# Altium schematic sheet MCU.SchDoc
size A3; SheetNumber: 5; SheetTotal: 8
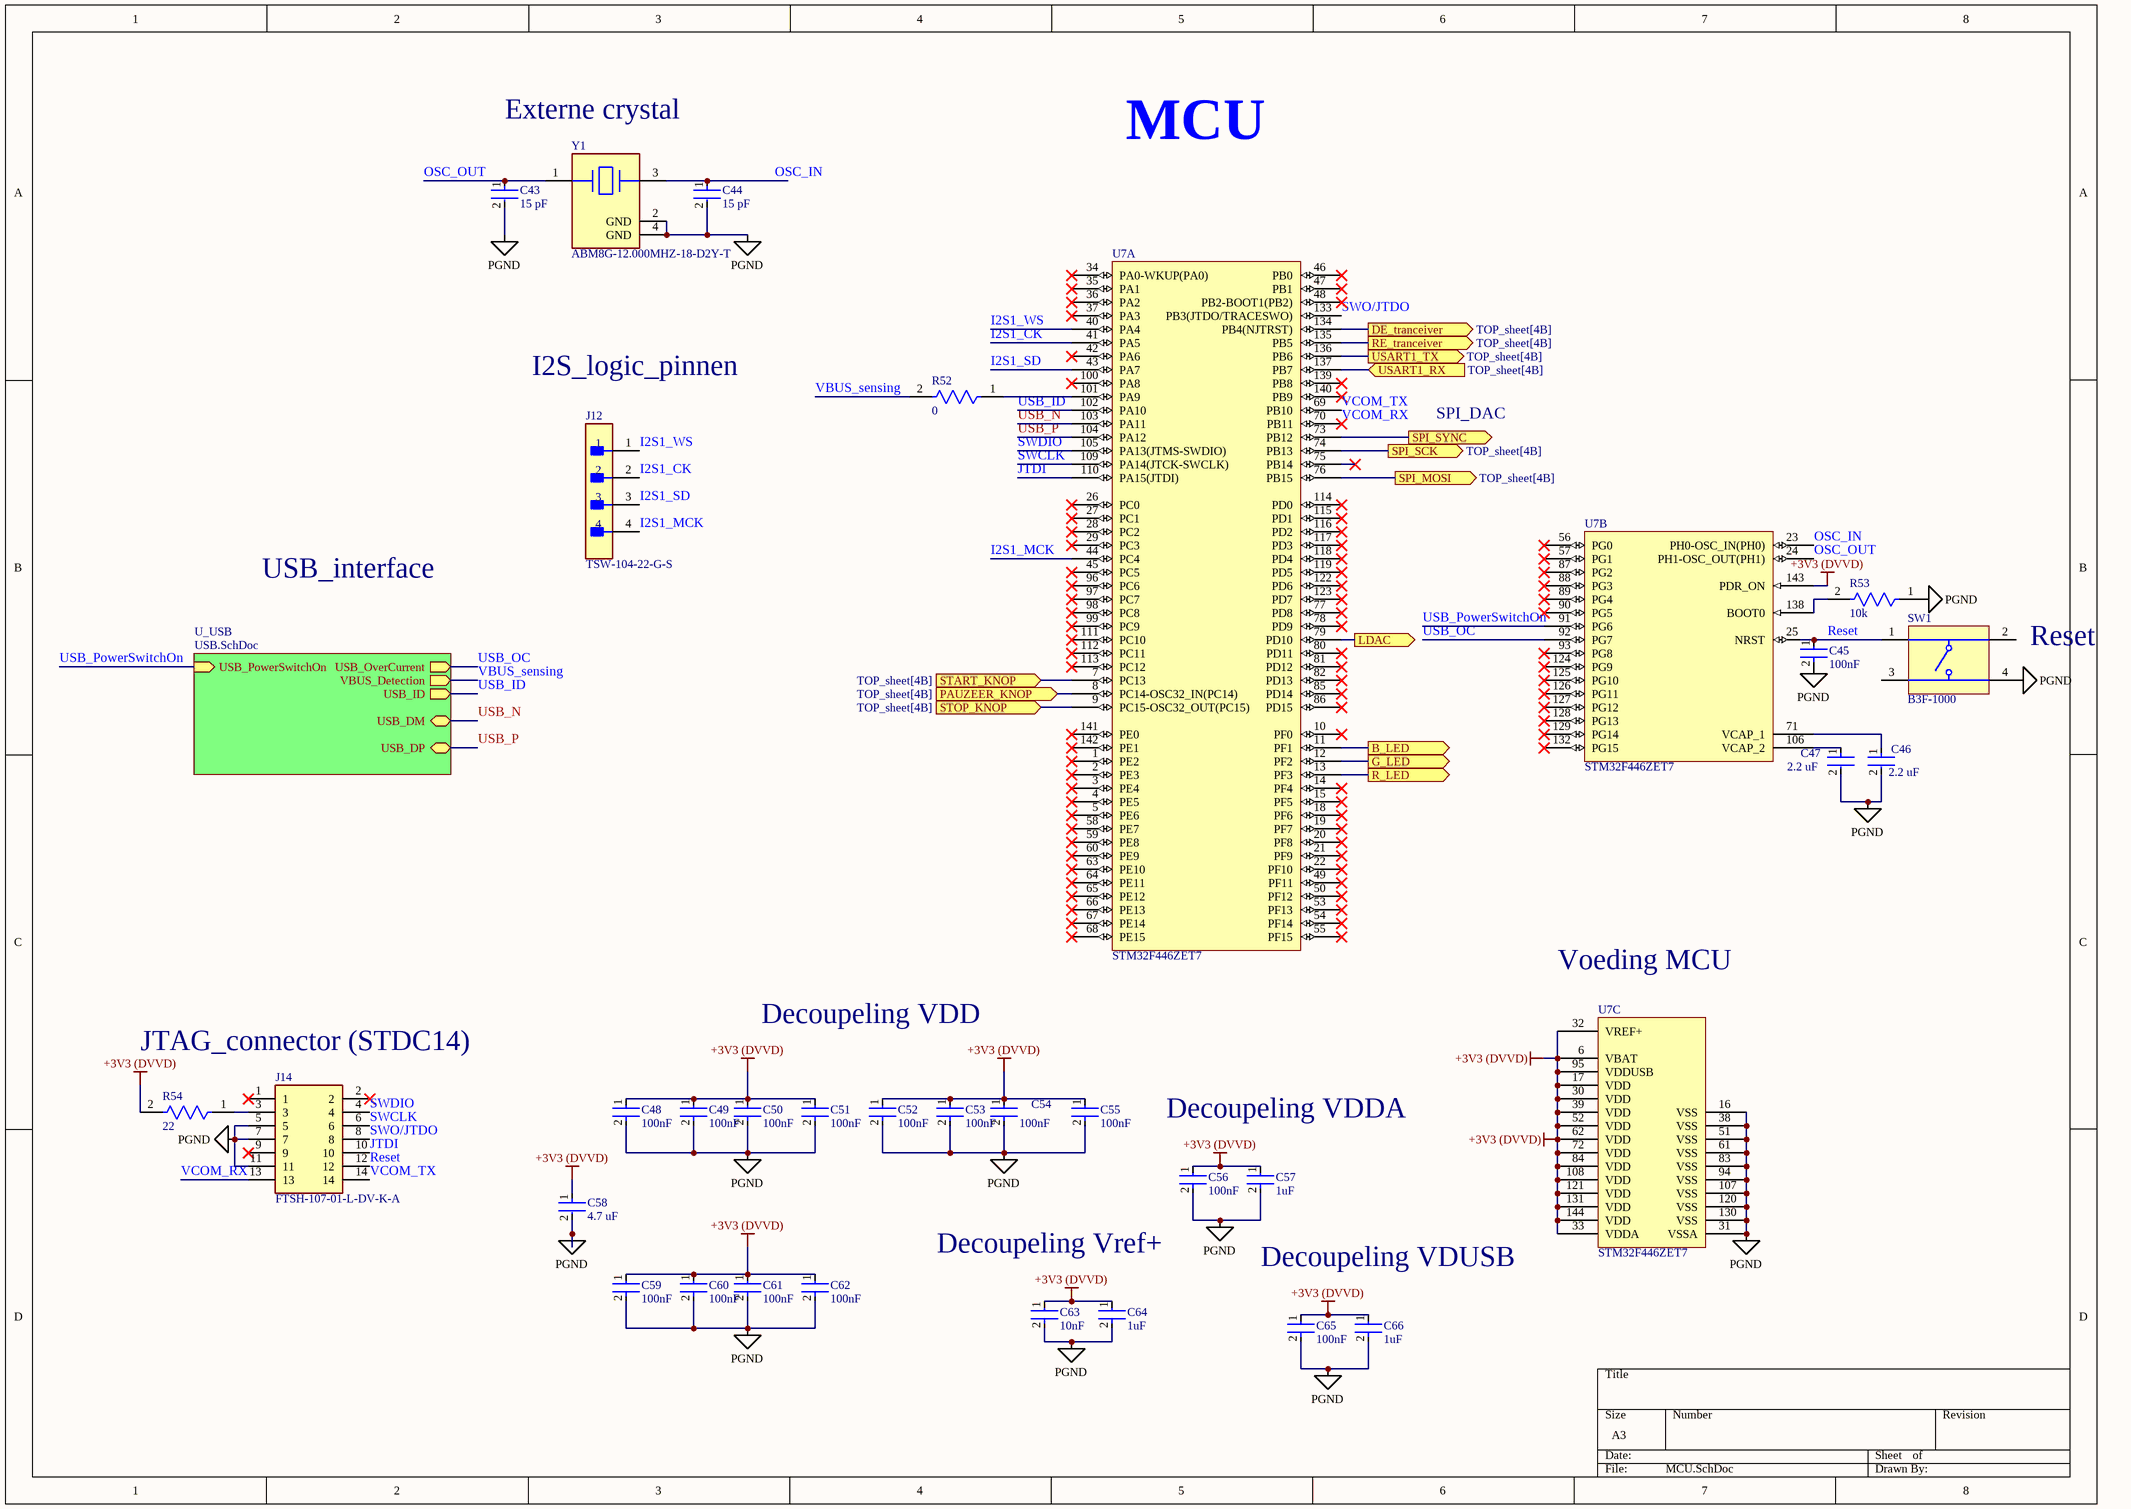
[diagram p0: MCU.SchDoc]

## Parts
C43  15 pF  [FP-AC0603-MFG]
C44  15 pF  [FP-AC0603-MFG]
C45  100nF  [FP-GRM15-MFG]
C46  2.2 uF  [FP-C0603C-CF-MFG]
C47  2.2 uF  [FP-C0603C-CF-MFG]
C48  100nF  [FP-GRM15-MFG]
C49  100nF  [FP-GRM15-MFG]
C50  100nF  [FP-GRM15-MFG]
C51  100nF  [FP-GRM15-MFG]
C52  100nF  [FP-GRM15-MFG]
C53  100nF  [FP-GRM15-MFG]
C54  100nF  [FP-GRM15-MFG]
C55  100nF  [FP-GRM15-MFG]
C56  100nF  [FP-GRM15-MFG]
C57  1uF  [FP-GRM15-MFG]
C58  4.7 uF  [FP-C0603C-CF-MFG]
C59  100nF  [FP-GRM15-MFG]
C60  100nF  [FP-GRM15-MFG]
C61  100nF  [FP-GRM15-MFG]
C62  100nF  [FP-GRM15-MFG]
C63  10nF  [FP-GRM15-MFG]
C64  1uF  [FP-GRM15-MFG]
C65  100nF  [FP-GRM15-MFG]
C66  1uF  [FP-GRM15-MFG]
J12  TSW-104-22-G-S  [FP-TSW-104-22-G-S-MFG]
J14  FTSH-107-01-L-DV-K-A  [FTSH-107-XX-YYY-DV-K-A]
R52  0  [FP-CRCW1206-MFG]
R53  10k  [FP-RC1608-IPC_B]
R54  22  [FP-RC1608-IPC_B]
SW1  B3F-1000  [OMRON-B3F-1000-4_V]
U7  STM32F446ZET7  [STM-LQFP144_M]  (parts A,B,C of 3)
Y1  ABM8G-12.000MHZ-18-D2Y-T  [FP-ABM8G-MFG]

## Sub-sheets
U_USB = USB.SchDoc: USB_PowerSwitchOn (in), USB_OverCurrent (out), USB_DM (bidir), USB_DP (bidir), VBUS_Detection (out), USB_ID (out)

## Ports
B_LED (out, see TOP_sheet[4B]), DE_tranceiver (out, see TOP_sheet[4B]), G_LED (out, see TOP_sheet[4B]), LDAC (out, see TOP_sheet[4B], DAC[1B]), PAUZEER_KNOP (in, see TOP_sheet[4B]), R_LED (out, see TOP_sheet[4B]), RE_tranceiver (out, see TOP_sheet[4B]), SPI_MOSI (out, see TOP_sheet[4B]), SPI_SCK (out, see TOP_sheet[4B]), SPI_SYNC (out, see TOP_sheet[4B]), START_KNOP (in, see TOP_sheet[4B]), STOP_KNOP (in, see TOP_sheet[4B]), USART1_RX (in, see TOP_sheet[4B]), USART1_TX (out, see TOP_sheet[4B])

## Nets
+3V3 (DVVD): C48.1 C49.1 C50.1 C51.1 C52.1 C53.1 C54.1 C55.1 C56.1 C57.1 C58.1 C59.1 C60.1 C61.1 C62.1 C63.1 C64.1 C65.1 C66.1 R54.2 U7.6(VBAT) U7.17(VDD) U7.30(VDD) U7.32(VREF+) U7.33(VDDA) U7.39(VDD) U7.52(VDD) U7.62(VDD) U7.72(VDD) U7.84(VDD) U7.95(VDDUSB) U7.108(VDD) U7.121(VDD) U7.131(VDD) U7.143(PDR_ON) U7.144(VDD)
PGND: C43.2 C44.2 C45.2 C46.2 C47.2 C48.2 C49.2 C50.2 C51.2 C52.2 C53.2 C54.2 C55.2 C56.2 C57.2 C58.2 C59.2 C60.2 C61.2 C62.2 C63.2 C64.2 C65.2 C66.2 J14.5 J14.7 J14.11 R53.1 SW1.4 U7.16(VSS) U7.31(VSSA) U7.38(VSS) U7.51(VSS) U7.61(VSS) U7.83(VSS) U7.94(VSS) U7.107(VSS) U7.120(VSS) U7.130(VSS) Y1.2(GND) Y1.4(GND)
B_LED: U7.11(PF1) ; port B_LED
DE_tranceiver: U7.134(PB4(NJTRST)) ; port DE_tranceiver
G_LED: U7.12(PF2) ; port G_LED
I2S1_CK: J12.2 U7.41(PA5)
I2S1_MCK: J12.4 U7.44(PC4)
I2S1_SD: J12.3 U7.43(PA7)
I2S1_WS: J12.1 U7.40(PA4)
JTDI: J14.10 U7.110(PA15(JTDI))
LDAC: U7.79(PD10) ; port LDAC
OSC_IN: C44.1 U7.23(PH0-OSC_IN(PH0)) Y1.3
OSC_OUT: C43.1 U7.24(PH1-OSC_OUT(PH1)) Y1.1
PAUZEER_KNOP: U7.8(PC14-OSC32_IN(PC14)) ; port PAUZEER_KNOP
R_LED: U7.13(PF3) ; port R_LED
RE_tranceiver: U7.135(PB5) ; port RE_tranceiver
Reset: C45.1 J14.12 SW1.1 U7.25(NRST)
SPI_MOSI: U7.76(PB15) ; port SPI_MOSI
SPI_SCK: U7.74(PB13) ; port SPI_SCK
SPI_SYNC: U7.73(PB12) ; port SPI_SYNC
START_KNOP: U7.7(PC13) ; port START_KNOP
STOP_KNOP: U7.9(PC15-OSC32_OUT(PC15)) ; port STOP_KNOP
SWCLK: J14.6 U7.109(PA14(JTCK-SWCLK))
SWDIO: J14.4 U7.105(PA13(JTMS-SWDIO))
SWO/JTDO: J14.8 U7.133(PB3(JTDO/TRACESWO))
USART1_RX: U7.137(PB7) ; port USART1_RX
USART1_TX: U7.136(PB6) ; port USART1_TX
USB_ID: U7.102(PA10) ; sheet U_USB/USB_ID
USB_N: U7.103(PA11) ; sheet U_USB/USB_DM
USB_OC: U7.92(PG7) ; sheet U_USB/USB_OverCurrent
USB_P: U7.104(PA12) ; sheet U_USB/USB_DP
USB_PowerSwitchOn: U7.91(PG6) ; sheet U_USB/USB_PowerSwitchOn
VBUS_sensing: R52.2 ; sheet U_USB/VBUS_Detection
VCOM_RX: J14.13 U7.70(PB11)
VCOM_TX: J14.14 U7.69(PB10)
NetC46_1: C46.1 U7.71(VCAP_1)
NetC47_1: C47.1 U7.106(VCAP_2)
NetJ14_3: J14.3 R54.1
NetR52_1: R52.1 U7.101(PA9)
NetR53_2: R53.2 U7.138(BOOT0)

Not connected (* = marked no-connect by the designer): J14 1* 2* 9*; SW1 2 3; U7 1(PE2)* 2(PE3)* 3(PE4)* 4(PE5)* 5(PE6)* 10(PF0)* 14(PF4)* 15(PF5)* 18(PF6)* 19(PF7)* 20(PF8)* 21(PF9)* 22(PF10)* 26(PC0)* 27(PC1)* 28(PC2)* 29(PC3)* 34(PA0-WKUP(PA0))* 35(PA1)* 36(PA2)* 37(PA3)* 42(PA6)* 45(PC5)* 46(PB0)* 47(PB1)* 48(PB2-BOOT1(PB2))* 49(PF11)* 50(PF12)* 53(PF13)* 54(PF14)* 55(PF15)* 56(PG0)* 57(PG1)* 58(PE7)* 59(PE8)* 60(PE9)* 63(PE10)* 64(PE11)* 65(PE12)* 66(PE13)* 67(PE14)* 68(PE15)* 75(PB14)* 77(PD8)* 78(PD9)* 80(PD11)* 81(PD12)* 82(PD13)* 85(PD14)* 86(PD15)* 87(PG2)* 88(PG3)* 89(PG4)* 90(PG5)* 93(PG8)* 96(PC6)* 97(PC7)* 98(PC8)* 99(PC9)* 100(PA8)* 111(PC10)* 112(PC11)* 113(PC12)* 114(PD0)* 115(PD1)* 116(PD2)* 117(PD3)* 118(PD4)* 119(PD5)* 122(PD6)* 123(PD7)* 124(PG9)* 125(PG10)* 126(PG11)* 127(PG12)* 128(PG13)* 129(PG14)* 132(PG15)* 139(PB8)* 140(PB9)* 141(PE0)* 142(PE1)*

## Notes on the sheet
- Externe crystal
- MCU
- I2S_logic_pinnen
- SPI_DAC
- USB_interface
- (near SW1) Reset
- Voeding MCU
- JTAG_connector (STDC14)
- Decoupeling VDD
- Decoupeling VDDA
- Decoupeling Vref+
- Decoupeling VDUSB

## Library data of the parts
C43 C44 = CMP-03422-001062-1: AC0603 15 pF NP0 5.00% 50 V; Manufacturer Part Number: AC0603JRNPO9BN271; Manufacturer: Yageo; Generic part Eurocircuits:: GPC0603150; Material: Ceramic; Value: 30 pF; Tolerance: 0.05; Voltage Rating: 50 V; Temperature Coefficient: 15%; Automotive Grade: Grade 1; ComponentLink2URL: http://www.yageo.com/documents/recent/UPY-AC_NP0X7R_16V-to-630V_12.pdf; Capacitance: 30 pF; Lead Free: Yes; Automotive: Yes; Package: AC0603; RoHS: TRUE; Device Class L2: Capacitors; Footprint Url: http://www.yageo.com/exep/pages/download/literatures/UPY-C_GEN_24.pdf; Height: 0.9mm; Category: Cap; Device Class L1: Passive Components; Temperature: -55°C to +125°C; Ipc Land Pattern Name: CAPC16080X80; Octopart: https://octopart.com/ac0603jrnpo9bn271-yageo-87214073; ComponentLink2Description: Datasheet; Device Class L3: Ceramic Capacitors; Temperature Characteristic: NP0; Temperature Range High: +125°C; Temperature Range Low: -55°C
C45 C48-C56 C59-C62 C65 = CMP-2100-03641-2: CAP CER 0.1UF 16V X7R 0402; Manufacturer Part Number: GRM155R71C104KA88D; Manufacturer: Murata; Eurocircuits generic parts: GPC0402104; Standoff Height: 0mm; Tolerance: 10%; Voltage Rating: 16Vdc; Material: Ceramic; Capacitance: 0.10μF; Value: 0.10μF; RoHS: TRUE; Temperature Characteristic: X7R; Octopart: https://octopart.com/grm155r71c104ka88d-murata-196880; Digikey Description: CAP CER 0.1UF 16V X7R 0402; Device Class L3: Ceramic Capacitors; Height: 0.55mm; ComponentLink2Description: Datasheet; Temperature Range Low: -55°C; Ipc Land Pattern Name: CAPC10050X219; ComponentLink2URL: https://search.murata.co.jp/Ceramy/image/img/A01X/G101/ENG/GRM155R71H471KA01-01A.pdf; Device Class L1: Passive Components; Lead Free: yes; Category: Cap; Package: GRM15; Temperature: -55°C to +125°C; Device Class L2: Capacitors; Temperature Range High: +125°C; Mouser Description: 0402 0.1 uF 16V ±10 % Tolerance X7R SMT Multilayer Ceramic Capacitor
C46 C47 = CMP-2006-03056-2: CAP CER 2.2 UF 50V 5% X7R 0603; Manufacturer Part Number: C0603C104J5RACTU; Manufacturer: KEMET; Generic part Eurocircuits:: GPC0603225-10; Automotive Grade: Grade 1; Tolerance: 0.05; Capacitance: 2.2 μF; Value: 2.2 μF; Material: Ceramic; Temperature Coefficient: 30ppm/°C; ComponentLink2Description: Datasheet; Voltage Rating: 50 V; Digikey Description: CAP CER 0.1UF 50V 5% X7R 0603; Temperature Range High: +125°C; Device Class L2: Capacitors; Octopart: https://octopart.com/c0603c104j5ractu-kemet-10440638; RoHS: TRUE; Mouser Description: Multilayer Ceramic Capacitors MLCC - SMD/SMT 50volts 0.1uF X7R 5%; Temperature Range Low: -55°C; Automotive: Yes; Lead Free: Yes; ComponentLink2URL: https://api.kemet.com/component-edge/download/datasheet/C0603C100J5GACAUTO.pdf; Device Class L3: Ceramic Capacitors; Package: C0603C-CF; Category: Cap; Temperature: -55°C to +125°C; Height: 0.87mm; Temperature Characteristic: X7R; Device Class L1: Passive Components
C57 C64 C66 = CMP-2100-03641-2: CAP CER 1UF 16V X7R 0402; Manufacturer Part Number: GRM155R71C104KA88D; Manufacturer: Murata; Eurocircuits generic parts: GPC0402105-16; Standoff Height: 0mm; Tolerance: 10%; Voltage Rating: 16Vdc; Material: Ceramic; Capacitance: 1μF; Value: 1μF; RoHS: TRUE; Temperature Characteristic: X7R; Octopart: https://octopart.com/grm155r71c104ka88d-murata-196880; Digikey Description: CAP CER 0.1UF 16V X7R 0402; Device Class L3: Ceramic Capacitors; Height: 0.55mm; ComponentLink2Description: Datasheet; Temperature Range Low: -55°C; Ipc Land Pattern Name: CAPC10050X219; ComponentLink2URL: https://search.murata.co.jp/Ceramy/image/img/A01X/G101/ENG/GRM155R71H471KA01-01A.pdf; Device Class L1: Passive Components; Lead Free: yes; Category: Cap; Package: GRM15; Temperature: -55°C to +125°C; Device Class L2: Capacitors; Temperature Range High: +125°C; Mouser Description: 0402 0.1 uF 16V ±10 % Tolerance X7R SMT Multilayer Ceramic Capacitor
C58 = CMP-2006-03056-2: CAP CER 4.7 UF 50V 5% X7R 0603; Manufacturer Part Number: C0603C104J5RACTU; Manufacturer: KEMET; Generic part Eurocircuits:: GPC0603475-10; Automotive Grade: Grade 1; Tolerance: 0.05; Capacitance: 4.7 μF; Value: 4.7 μF; Material: Ceramic; Temperature Coefficient: 30ppm/°C; ComponentLink2Description: Datasheet; Voltage Rating: 50 V; Digikey Description: CAP CER 0.1UF 50V 5% X7R 0603; Temperature Range High: +125°C; Device Class L2: Capacitors; Octopart: https://octopart.com/c0603c104j5ractu-kemet-10440638; RoHS: TRUE; Mouser Description: Multilayer Ceramic Capacitors MLCC - SMD/SMT 50volts 0.1uF X7R 5%; Temperature Range Low: -55°C; Automotive: Yes; Lead Free: Yes; ComponentLink2URL: https://api.kemet.com/component-edge/download/datasheet/C0603C100J5GACAUTO.pdf; Device Class L3: Ceramic Capacitors; Package: C0603C-CF; Category: Cap; Temperature: -55°C to +125°C; Height: 0.87mm; Temperature Characteristic: X7R; Device Class L1: Passive Components
C63 = CMP-2100-03641-2: CAP CER 10nF 16V X7R 0402; Manufacturer Part Number: GRM155R71C104KA88D; Manufacturer: Murata; Eurocircuits generic parts: GPC0402103; Standoff Height: 0mm; Tolerance: 10%; Voltage Rating: 16Vdc; Material: Ceramic; RoHS: TRUE; Temperature Characteristic: X7R; Octopart: https://octopart.com/grm155r71c104ka88d-murata-196880; Digikey Description: CAP CER 0.1UF 16V X7R 0402; Device Class L3: Ceramic Capacitors; Height: 0.55mm; ComponentLink2Description: Datasheet; Temperature Range Low: -55°C; Ipc Land Pattern Name: CAPC10050X219; ComponentLink2URL: https://search.murata.co.jp/Ceramy/image/img/A01X/G101/ENG/GRM155R71H471KA01-01A.pdf; Device Class L1: Passive Components; Lead Free: yes; Category: Cap; Package: GRM15; Temperature: -55°C to +125°C; Device Class L2: Capacitors; Capacitance: 10nF; Value: 10nF; Temperature Range High: +125°C; Mouser Description: 0402 0.1 uF 16V ±10 % Tolerance X7R SMT Multilayer Ceramic Capacitor; Parameter 1: *
J12 = CMP-02766-001236-1: GENERIC PART NUMBER: GPHA-1X04 / CONN HEADER VERT 4POS 2.54MM; Number of Contacts: 4; Gender: Male; Termination: Solder; Pitch: 2.54mm; Mount: Through Hole; Number of Rows: 1; Packaging: Bulk; Contact Material: Bronze; Contact Plating: Gold; REACH SVHC: No SVHC; Radiation Hardening: No; GENERIC PART NUMBER: GPHA-1X04
J14 = FTSH-107-01-L-DV-K-A: Board Connector, 14 Contact(s), 2 Row(s), Male, Straight, 0.05 inch Pitch, Surface Mount Terminal, Locking, Receptacle; Manufacturer_Name: SAMTEC; Pitch: 1.27mm; Number of Contacts: 14; Datasheet Link: http://suddendocs.samtec.com/prints/ftsh-1xx-xx-xxx-dv-xxx-xxx-mkt.pdf; Manufacturer_Part_Number: FTSH-107-01-L-DV-K-A; Mouser Part Number: 200-FTSH10701LDVKA; Mouser Price/Stock: https://www.mouser.co.uk/ProductDetail/Samtec/FTSH-107-01-L-DV-K-A?qs=PB6%2FjmICvI3xEHFou4PhNg%3D%3D; Arrow Part Number: FTSH-107-01-L-DV-K-A; Arrow Price/Stock: https://www.arrow.com/en/products/ftsh-107-01-l-dv-k-a/samtec?region=europe; Gender: Male
R52 = CMP-00030-39388935-1: CRCW12060000ZSTA Zero Ohm Resistor, Jumper, 1206 [3216 Metric], Thick Film, 250 mW, Surface Mount; Voltage Rating (DC): 200V; Max Power Dissipation: 250mW; Temperature Coefficient: 100ppm/°C; Resistance: 0Ω; Packaging: Cut Tape; Lead Free: Contains Lead; Height: 609.6µm; Military Standard: Not; Min Operating Temperature: -55°C; Weight: 10.007382mg; Depth: 1.6mm; Termination: SMD/SMT; Mount: Surface Mount; RoHS: Compliant; Case Code (Metric): 3216; Max Operating Temperature: 155°C; NexarPartId: 39388935; Length: 3.2mm; Features: Automotive AEC-Q200; Case Code (Imperial): 1206; Composition: Thick Film; Case/Package: 1206; Voltage Rating: 200V; Width: 1.6mm; Contact Plating: Lead, Tin; Number of Terminations: 2; REACH SVHC: Unknown; Power Rating: 250mW; Radiation Hardening: No
R53 = CMP-13261-004935-1: Res Thick Film 0603 10kΩ 1% 0.1W ±100ppm/°C Molded SMD T/R / Generic part Eurocircuits: / GPR060310K; Voltage Rating (DC): 50V; Power Rating: 100mW; Resistance: 10k; Contact Plating: Tin; Depth: 0.8mm; Width: 800um; Tolerance: 1%; Lead Free: Lead Free; Composition: Thick Film; Military Standard: Not; Temperature Coefficient: 100ppm/°C; Radiation Hardening: No; Length: 1.6mm; Case/Package: 0603; Max Operating Temperature: 155°C; Packaging: Tape and Reel; Min Operating Temperature: -55°C; Generic part Eurocircuits:: GPR060310K
R54 = CMP-13261-004935-1: Res Thick Film 0603 22Ω 1% 0.1W ±100ppm/°C Molded SMD T/R / Generic part Eurocircuits: / GPR060310K; Generic part Eurocircuits:: GPR060322R; Voltage Rating (DC): 50V; Power Rating: 100mW; Resistance: 22; Contact Plating: Tin; Depth: 0.8mm; Width: 800um; Tolerance: 1%; Lead Free: Lead Free; Composition: Thick Film; Military Standard: Not; Temperature Coefficient: 100ppm/°C; Radiation Hardening: No; Length: 1.6mm; Case/Package: 0603; Max Operating Temperature: 155°C; Packaging: Tape and Reel; Min Operating Temperature: -55°C
SW1 = CMP-1677-00002-1: Tactile Switch, SPST-NO, 0.05 A, 5 to 24 V, -25 to 70 degC, 4-Pin THD, RoHS, Bulk; Shielding: Shielded; Gender: Female; Capacitance: -45 f; Voltage Rating: 150 V; Current Rating: 1.5 A; Radiation Hardening: No; Contact Plating: Gold; Height: 14.99 mm; Min Operating Temperature: -40 degC; Packaging: Tray; ComponentLink2Description: Datasheet; ComponentLink1URL: http://www.omron.com/; Lead Pitch: 1.27 mm; RoHSCompliant: true; Pins: 8; PackageReference: B3F-1000; Width: 25.4 mm; Contact Material: Brass; ComponentLink2URL: http://www.omron.com/ecb/products/pdf/en-b3f.pdf; PackageDescription: 4-Pin Through Hole Device, Body 6 x 6 mm; DatasheetVersion: Jan-15; ComponentLink1Description: Manufacturer URL; Package Quantity: 1080; Mount: Through Hole; Length: 18.34 mm; Max Operating Temperature: 70 degC
U7 = CMP-0243-00227-1: ARM Cortex-M4 32-bit MCU+FPU, 512 KB Flash, 128 KB Internal RAM, 114 I/Os, 144-Pin LQFP, -40 to 105 degC, Tray; Operating Frequency(F) (Processor speed) (MHz): 180; FLASH Size (Prog) (kB): 512; D/A Converter: 2; Internal RAM Size (kB): 128; I/Os (High Current): 114; Supply Voltage(Vcc) min (V): 1.7; Package Reference: 144-Pin Low Profile Quad Flat Package, Body 20 x 20 mm, Pitch 0.5 mm; Package Description: LQFP144; DatasheetVersion: Rev. 6; ComponentLink2Description: Datasheet; Mounting Technology: Surface Mount; Packing: Tray; ComponentLink2URL: http://www.st.com/st-web-ui/static/active/en/resource/technical/document/datasheet/DM00141306.pdf; Core: ARM Cortex-M4; ComponentLink1URL: http://www.st.com/; ComponentLink1Description: Manufacturer URL
Y1 = CMP-2000-05039-3: Crystal 12MHz ±20ppm (Tol) ±30ppm (Stability) 18pF FUND 120Ω 4-Pin SMD T/R; Series Resistance: 120R; Max Operating Temperature: 85°C; Mount: Surface Mount; Width: 2.5mm; Series: ABM8G; Termination: SMD/SMT; Frequency Tolerance: 20ppm; Tolerance: 20ppm; Min Operating Temperature: -40°C; Operating Frequency: 12 MHz; Depth: 2.5mm; Load Capacitance: 18pF; Number of Pins: 4; Length: 3.2mm; Radiation Hardening: No; Frequency Stability: 30ppm; Height: 1mm; Packaging: Tape and Reel; Package Quantity: 1000; ESR (Equivalent Series Resistance): 120R; Lead Free: Lead Free; Frequency: 12MHz; Case/Package: CSMD